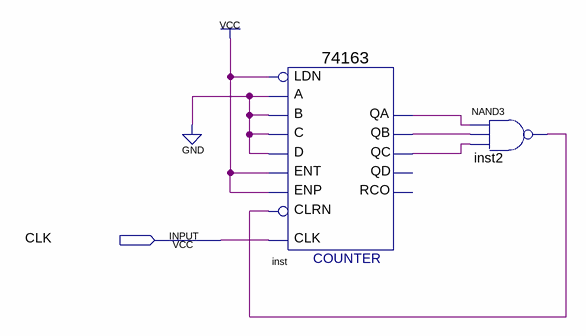
[diagram p0: schematic sheet]
// Quartus schematic SpecialCount.bdf as structural Verilog: 2 symbols, 1 pins
module SpecialCount (
  input  CLK
);

  wire inst2_out, inst_qa, inst_qb, inst_qc;

  \74163  inst (
    .C(1'b0), .B(1'b0), .A(1'b0), .ENT(1'b1), .D(1'b0), .CLRN(inst2_out), .CLK(CLK), .ENP(1'b1), .LDN(1'b1),
    .QA(inst_qa), .QB(inst_qb), .QC(inst_qc));  // open: QD, RCO
  nand inst2 (inst2_out, inst_qa, inst_qb, inst_qc);
endmodule
